# Altium schematic sheet CAN.SchDoc
size 420 x 297 mm; Scale: 1:1; DocumentType: Схема электрическая принципиальная; FirstReferrence: АБВГ.123456.001
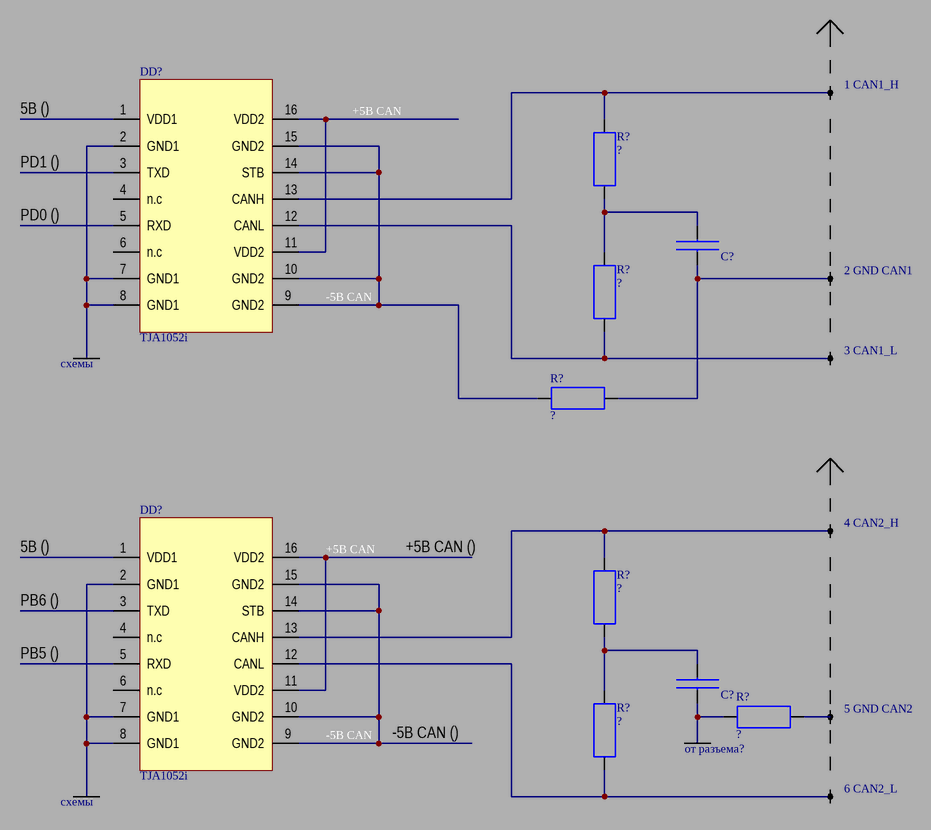
[diagram p0: CAN.SchDoc]

## Parts
(Parts that share a designator on the sheet are numbered #1, #2 ... from top to bottom, then left to right.)
C?#1  ?  [CAP0805]  (value not drawn)
C?#2  ?  [CAP0805]  (value not drawn)
DD?#1  TJA1052i  [SOP127P1030X265-16N]
DD?#2  TJA1052i  [SOP127P1030X265-16N]
R?#1  ?  [RES0805]
R?#2  ?  [RES0805]
R?#3  ?  [RES0805]
R?#4  ?  [RES0805]
R?#5  ?  [RES0805]
R?#6  ?  [RES0805]
X?#1  1 CAN1_H  [PLD10]  (part A of 10)
X?#2  2 GND CAN1  [PLD10]  (part B of 10)
X?#3  3 CAN1_L  [PLD10]  (part C of 10)
X?#4  4 CAN2_H  [PLD10]  (part D of 10)
X?#5  5 GND CAN2  [PLD10]  (part E of 10)
X?#6  6 CAN2_L  [PLD10]  (part F of 10)

## Nets
+5В CAN: DD?#1.11(VDD2) DD?#1.16(VDD2) DD?#2.11(VDD2) DD?#2.16(VDD2)
-5В CAN: DD?#1.9(GND2) DD?#1.10(GND2) DD?#1.14(STB) DD?#1.15(GND2) DD?#2.9(GND2) DD?#2.10(GND2) DD?#2.14(STB) DD?#2.15(GND2) R?#3.2
NetC?#1_1: C?#1.1 R?#3.1 X?#2.2
NetC?#1_2: C?#1.2 R?#1.1 R?#2.2
NetC?#2_1: C?#2.1 R?#5.2
NetC?#2_2: C?#2.2 R?#4.1 R?#6.2
NetDD?#1_2: DD?#1.2(GND1) DD?#1.7(GND1) DD?#1.8(GND1)
NetDD?#1_12: DD?#1.12(CANL) R?#2.1 X?#3.3
NetDD?#1_13: DD?#1.13(CANH) R?#1.2 X?#1.1
NetDD?#2_2: DD?#2.2(GND1) DD?#2.7(GND1) DD?#2.8(GND1)
NetDD?#2_12: DD?#2.12(CANL) R?#6.1 X?#6.6
NetDD?#2_13: DD?#2.13(CANH) R?#4.2 X?#4.4
NetR?#5_1: R?#5.1 X?#5.5

Not connected (* = marked no-connect by the designer): DD?#1 1(VDD1) 3(TXD) 4(n.c) 5(RXD) 6(n.c); DD?#2 1(VDD1) 3(TXD) 4(n.c) 5(RXD) 6(n.c)

## Notes on the sheet
- 5В ()
- PD1 ()
- PD0 ()
- схемы
- +5В CAN ()
- PB6 ()
- PB5 ()
- -5В CAN ()
- (near R?#5) от разъема?
- Подп. и дата
- Инв. № дубл.
- Взам. инв. №
- Инв. № подл.
- Изм.
- Лист
- № докум.
- Подп.
- Дата
- 2.106-A3
- Копировал
- Формат А3

## Library data of the parts
C?#1 C?#2 = C_2
R?#1-R?#6 = R_1
X?#1-X?#6 = PLD10